# EasyEDA schematic SCH_kaerestei_2024-12-15.json
TITLE: PCB_KRSTI; REV: 1.0; Date: 2024-12-14; Sheet: 1/1; Company: CyanCloud
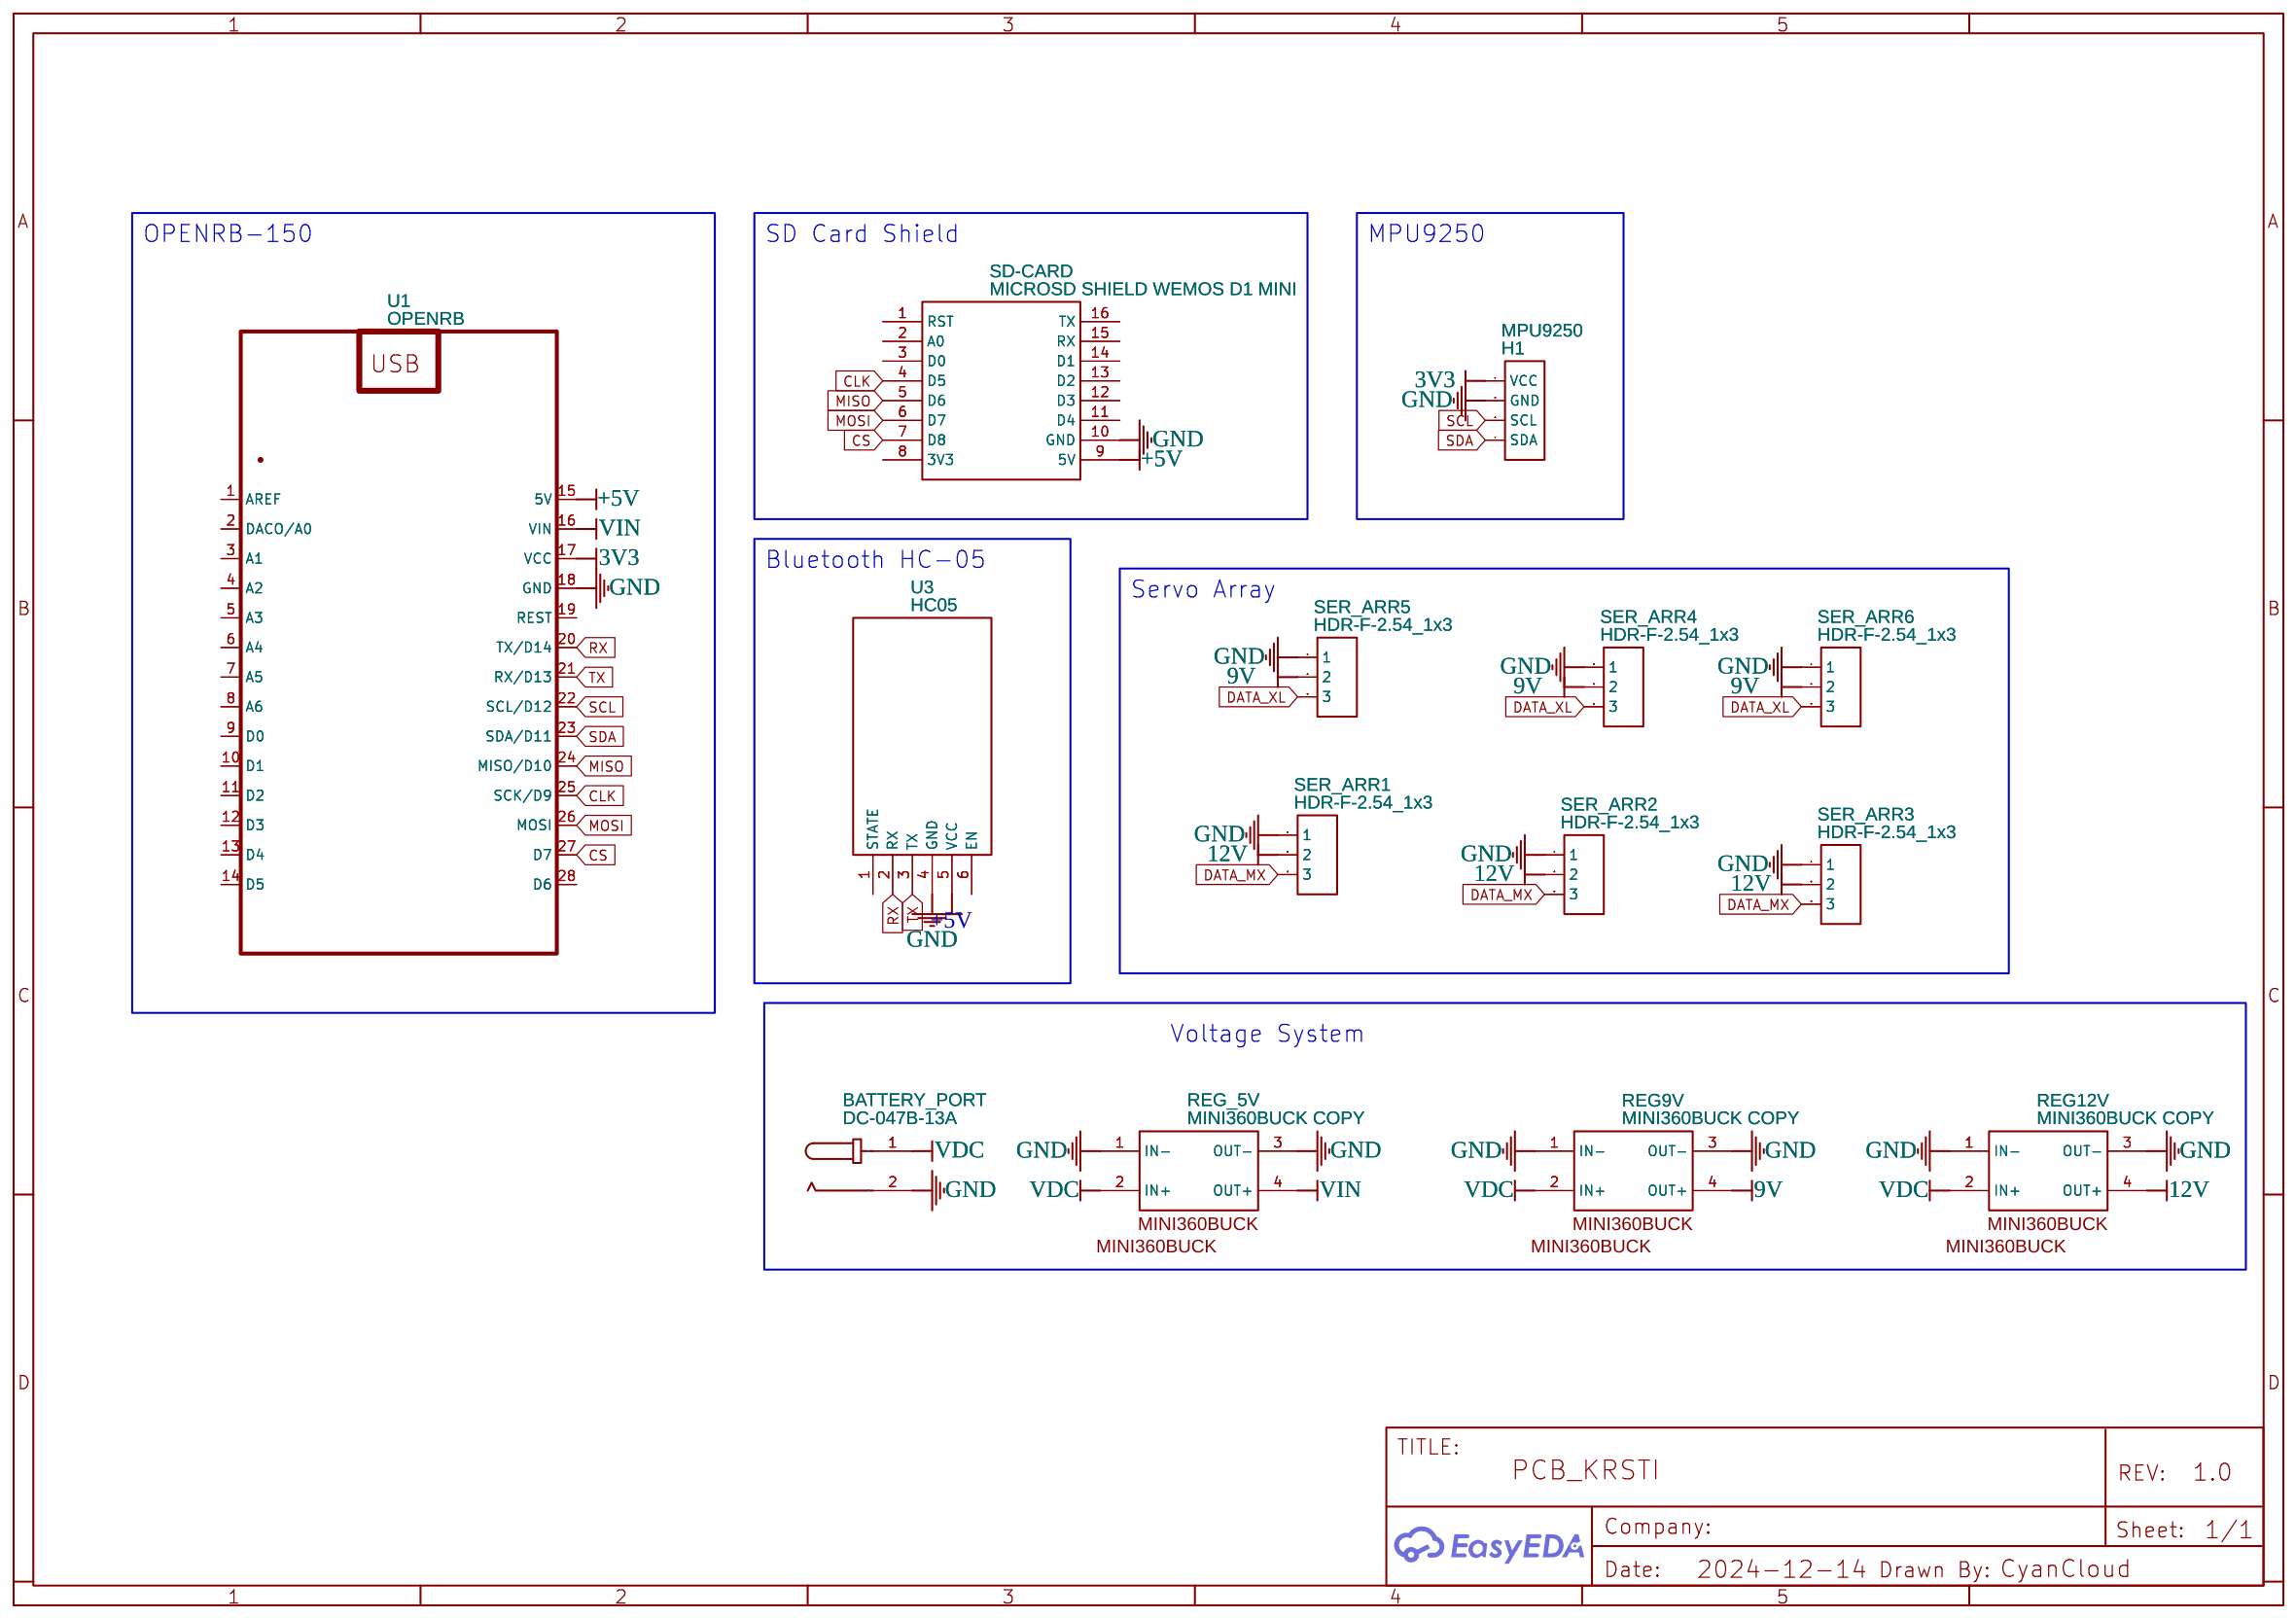
[diagram p0: schematic sheet]

## Parts
BATTERY_PORT  DC-047B-13A  [DC-IN-TH_DC-047B-13A]
MPU9250  H1  [HDR-F-2.54_1X4]
REG9V  MINI360BUCK COPY  [MINI360BUCK]
REG12V  MINI360BUCK COPY  [MINI360BUCK]
REG_5V  MINI360BUCK COPY  [MINI360BUCK]
SD-CARD  MICROSD SHIELD WEMOS D1 MINI  [MICROSD_SHIELD_WEMOS_D1_MINI]
SER_ARR1  HDR-F-2.54_1x3  [HDR-F-2.54_1X3]
SER_ARR2  HDR-F-2.54_1x3  [HDR-F-2.54_1X3]
SER_ARR3  HDR-F-2.54_1x3  [HDR-F-2.54_1X3]
SER_ARR4  HDR-F-2.54_1x3  [HDR-F-2.54_1X3]
SER_ARR5  HDR-F-2.54_1x3  [HDR-F-2.54_1X3]
SER_ARR6  HDR-F-2.54_1x3  [HDR-F-2.54_1X3]
U1  OPENRB  [OPENRB - QUANTAQ]
U3  HC05  [HC05]

## Library data of the parts
BATTERY_PORT = DC-047B-13A: Supplier: LCSC; Manufacturer: HRO; Contributor: LCSC; Supplier Part: C145923
MPU9250 = HDR-F-2.54_1x4: Supplier Part: C225501; Supplier: LCSC; Contributor: LCEDA_Lib
REG9V REG12V REG_5V = MINI360BUCK COPY: Contributor: Ryan White; sourceId: FRLFXR8qI; Manufacturer Part: Mini360; link: http://ali.pub/399f0z; Package Display: Yes
SD-CARD = MICROSD SHIELD WEMOS D1 MINI: Supplier Part: Micro SD V1.2.0; Supplier: Aliexpress; Contributor: Slava_SSS; Link: https://fr.aliexpress.com/item/32578362865.html?spm=a2g0o.productlist.0.0.6de91839SYtZCl&algo_pvid=6a0d35c9-b90c-419b-8429-50b5a2e737fc&algo_exp_id=6a0d35c9-b90c-419b-8429-50b5a2e737fc-1&pdp_ext_f=%7B
SER_ARR1-SER_ARR6 = HDR-F-2.54_1x3: Supplier Part: C146690; Supplier: LCSC; Contributor: LCEDA_Lib
U1 = OPENRB: Contributor: quantaq
U3 = HC05: Contributor: masm

## Nets
3V3: MPU9250.1(VCC) U1.17(VCC)
9V: REG9V.4(OUT+) SER_ARR4.2 SER_ARR5.2 SER_ARR6.2
12V: REG12V.4(OUT+) SER_ARR1.2 SER_ARR2.2 SER_ARR3.2
+5V: SD-CARD.9(5V) U1.15(5V) U3.5(VCC)
GND: BATTERY_PORT.2 MPU9250.2(GND) REG9V.1(IN-) REG9V.3(OUT-) REG12V.1(IN-) REG12V.3(OUT-) REG_5V.1(IN-) REG_5V.3(OUT-) SD-CARD.10(GND) SER_ARR1.1 SER_ARR2.1 SER_ARR3.1 SER_ARR4.1 SER_ARR5.1 SER_ARR6.1 U1.18(GND) U3.4(GND)
VIN: REG_5V.4(OUT+) U1.16(VIN)
CLK: SD-CARD.4(D5) U1.25(SCK/D9)
CS: SD-CARD.7(D8) U1.27(D7)
DATA_MX: SER_ARR1.3 SER_ARR2.3 SER_ARR3.3
DATA_XL: SER_ARR4.3 SER_ARR5.3 SER_ARR6.3
MISO: SD-CARD.5(D6) U1.24(MISO/D10)
MOSI: SD-CARD.6(D7) U1.26(MOSI)
RX: U1.20(TX/D14) U3.2(RX)
SCL: MPU9250.3(SCL) U1.22(SCL/D12)
SDA: MPU9250.4(SDA) U1.23(SDA/D11)
TX: U1.21(RX/D13) U3.3(TX)
VDC: BATTERY_PORT.1 REG9V.2(IN+) REG12V.2(IN+) REG_5V.2(IN+)

Not connected (* = marked no-connect by the designer): SD-CARD 1(RST) 2(A0) 3(D0) 8(3V3) 11(D4) 12(D3) 13(D2) 14(D1) 15(RX) 16(TX); U1 1(AREF) 2(DACO/A0) 3(A1) 4(A2) 5(A3) 6(A4) 7(A5) 8(A6) 9(D0) 10(D1) 11(D2) 12(D3) 13(D4) 14(D5) 19(REST) 28(D6); U3 1(STATE) 6(EN)

## Notes on the sheet
- OPENRB-150
- SD Card Shield
- MPU9250
- Bluetooth HC-05
- Servo Array
- Voltage System
